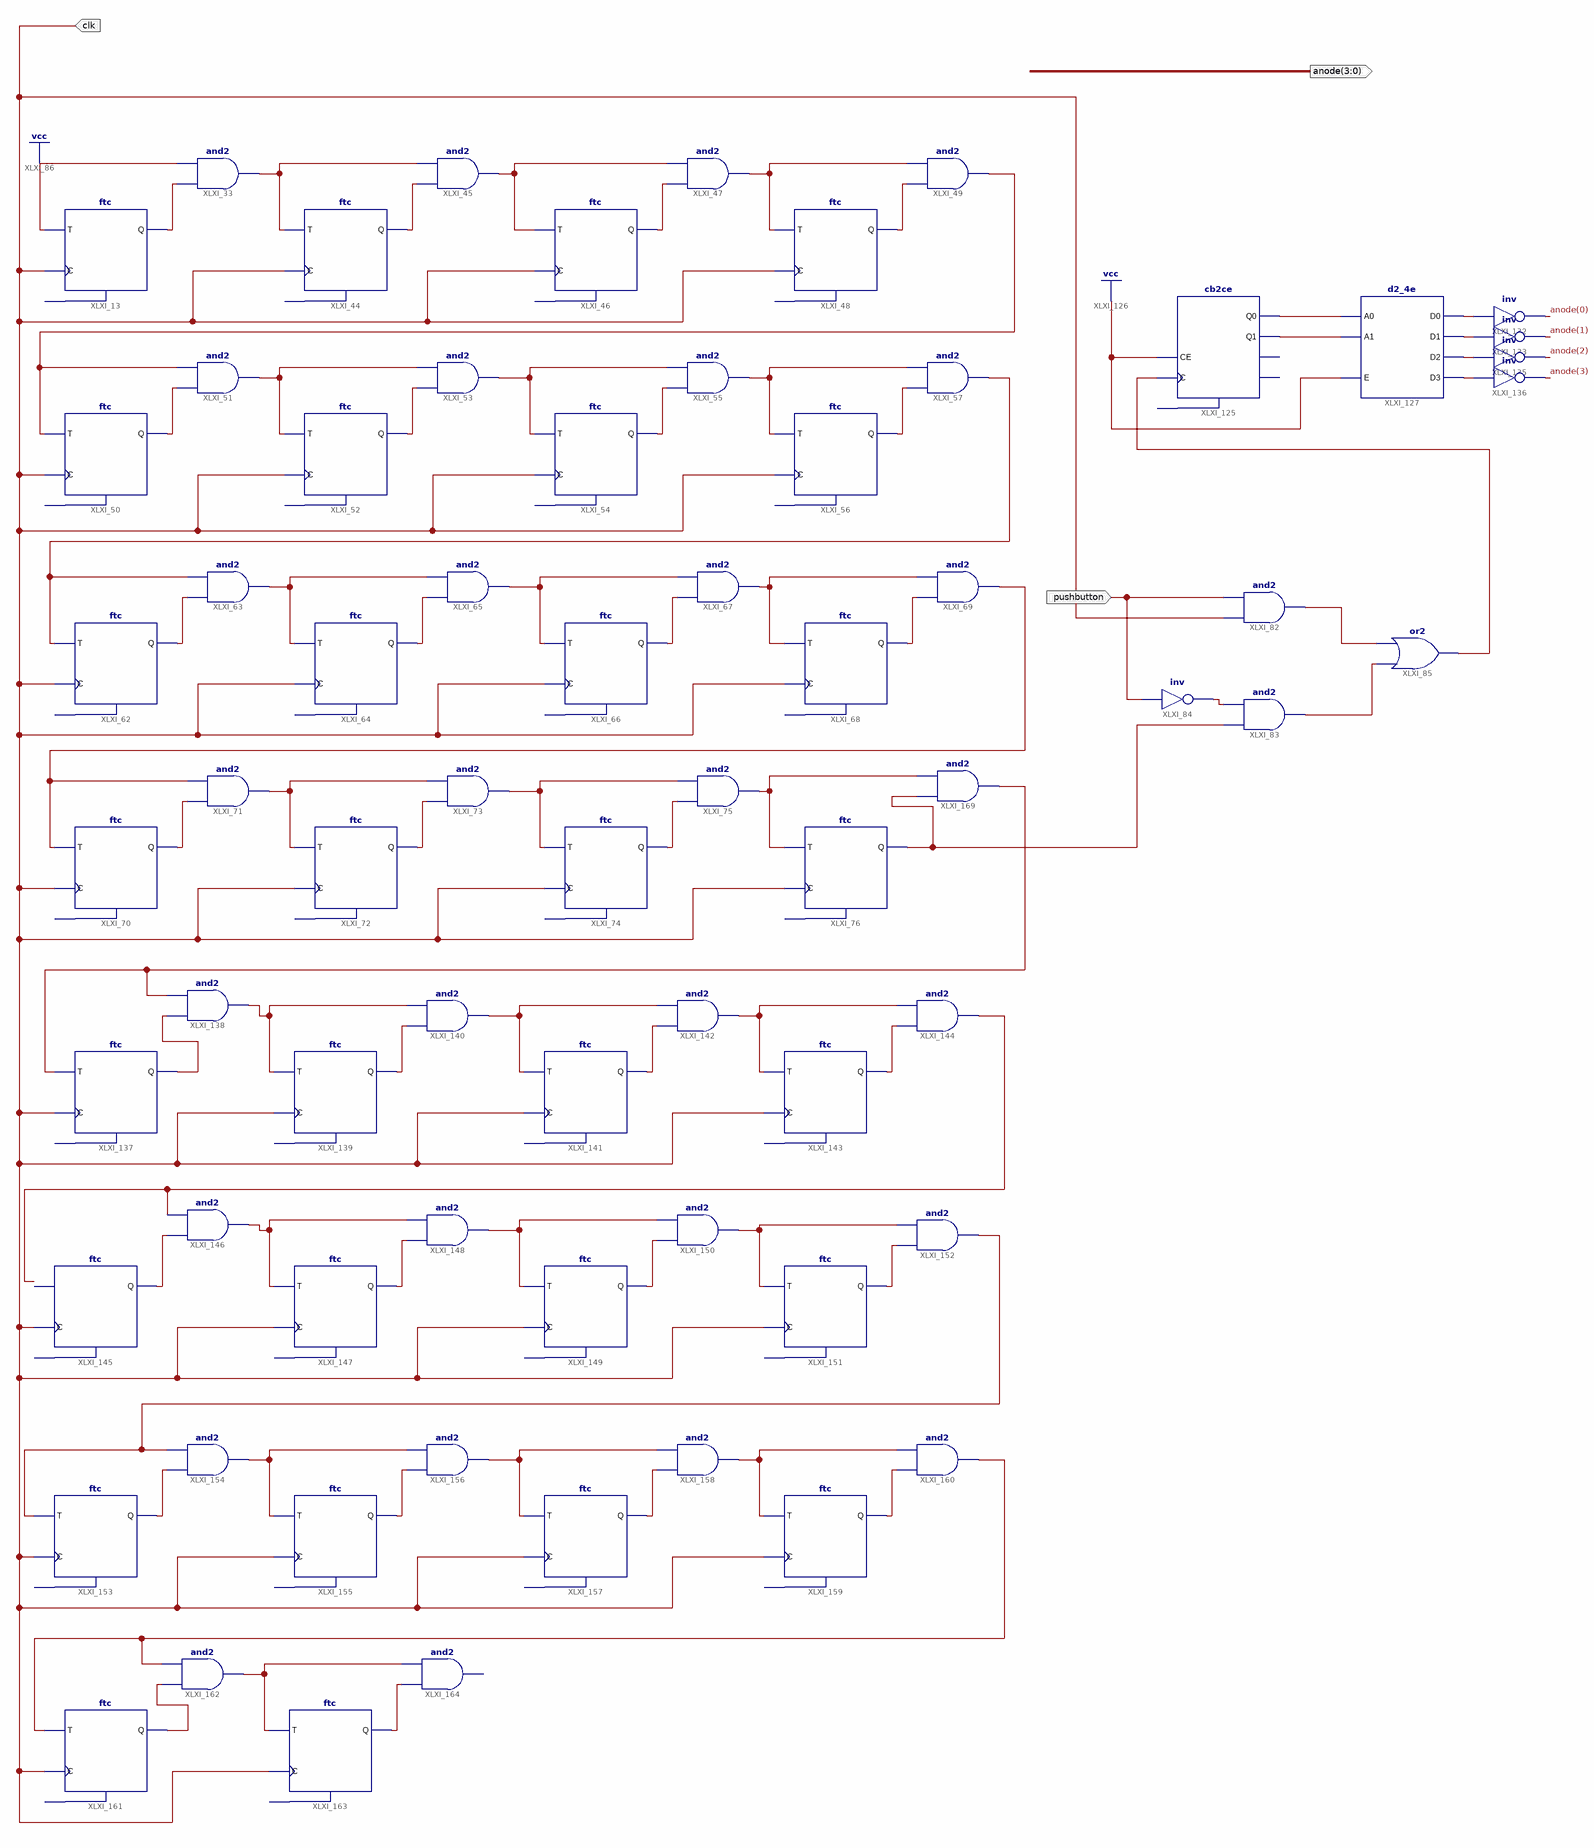
[diagram p0: schematic sheet 1]
// Xilinx ISE schematic Clocking.sch (artix7) as structural Verilog: 70 symbols, 3 ports
module Clocking (
  input  pushbutton,
  input  clk,
  output [3:0] anode
);

  wire XLXN_26, XLXN_47, XLXN_49, XLXN_52, XLXN_53, XLXN_55, XLXN_56, XLXN_58, XLXN_59, XLXN_61, XLXN_62,
       XLXN_64, XLXN_65, XLXN_67, XLXN_74, XLXN_76, XLXN_77, XLXN_79, XLXN_80, XLXN_82, XLXN_85, XLXN_86,
       XLXN_88, XLXN_89, XLXN_91, XLXN_92, XLXN_94, XLXN_114, XLXN_117, XLXN_118, XLXN_157, XLXN_160,
       XLXN_161, XLXN_172, XLXN_179, XLXN_180, XLXN_181, XLXN_182, XLXN_184, XLXN_186, XLXN_188, XLXN_190,
       XLXN_192, XLXN_194, XLXN_196, XLXN_198, XLXN_200, XLXN_202, XLXN_204, XLXN_206, XLXN_208, XLXN_210,
       XLXN_212, XLXN_214, XLXN_216, XLXN_218, XLXN_220, XLXN_222, XLXN_224, XLXN_226, XLXN_228, XLXN_230,
       XLXN_261, XLXN_269, XLXN_272, XLXN_274, XLXN_276, XLXN_285, XLXN_287;

  ftc XLXI_13 (.C(clk), .T(1'b1), .Q(XLXN_26));  // open: CLR
  and XLXI_33 (XLXN_47, XLXN_26, 1'b1);
  ftc XLXI_44 (.C(clk), .T(XLXN_47), .Q(XLXN_49));  // open: CLR
  and XLXI_45 (XLXN_172, XLXN_49, XLXN_47);
  ftc XLXI_46 (.C(clk), .T(XLXN_172), .Q(XLXN_52));  // open: CLR
  and XLXI_47 (XLXN_53, XLXN_52, XLXN_172);
  ftc XLXI_48 (.C(clk), .T(XLXN_53), .Q(XLXN_55));  // open: CLR
  and XLXI_49 (XLXN_56, XLXN_55, XLXN_53);
  ftc XLXI_50 (.C(clk), .T(XLXN_56), .Q(XLXN_58));  // open: CLR
  and XLXI_51 (XLXN_59, XLXN_58, XLXN_56);
  ftc XLXI_52 (.C(clk), .T(XLXN_59), .Q(XLXN_61));  // open: CLR
  and XLXI_53 (XLXN_62, XLXN_61, XLXN_59);
  ftc XLXI_54 (.C(clk), .T(XLXN_62), .Q(XLXN_64));  // open: CLR
  and XLXI_55 (XLXN_65, XLXN_64, XLXN_62);
  ftc XLXI_56 (.C(clk), .T(XLXN_65), .Q(XLXN_67));  // open: CLR
  and XLXI_57 (XLXN_74, XLXN_67, XLXN_65);
  ftc XLXI_62 (.C(clk), .T(XLXN_74), .Q(XLXN_76));  // open: CLR
  and XLXI_63 (XLXN_77, XLXN_76, XLXN_74);
  ftc XLXI_64 (.C(clk), .T(XLXN_77), .Q(XLXN_79));  // open: CLR
  and XLXI_65 (XLXN_80, XLXN_79, XLXN_77);
  ftc XLXI_66 (.C(clk), .T(XLXN_80), .Q(XLXN_82));  // open: CLR
  and XLXI_67 (XLXN_269, XLXN_82, XLXN_80);
  ftc XLXI_68 (.C(clk), .T(XLXN_269), .Q(XLXN_85));  // open: CLR
  and XLXI_69 (XLXN_86, XLXN_85, XLXN_269);
  ftc XLXI_70 (.C(clk), .T(XLXN_86), .Q(XLXN_88));  // open: CLR
  and XLXI_71 (XLXN_89, XLXN_88, XLXN_86);
  ftc XLXI_72 (.C(clk), .T(XLXN_89), .Q(XLXN_91));  // open: CLR
  and XLXI_73 (XLXN_92, XLXN_91, XLXN_89);
  ftc XLXI_74 (.C(clk), .T(XLXN_92), .Q(XLXN_94));  // open: CLR
  and XLXI_75 (XLXN_285, XLXN_94, XLXN_92);
  ftc XLXI_76 (.C(clk), .T(XLXN_285), .Q(XLXN_287));  // open: CLR
  and XLXI_82 (XLXN_117, clk, pushbutton);
  and XLXI_83 (XLXN_118, XLXN_287, XLXN_114);
  not XLXI_84 (XLXN_114, pushbutton);
  or XLXI_85 (XLXN_157, XLXN_118, XLXN_117);
  cb2ce XLXI_125 (.C(XLXN_157), .CE(1'b1), .Q0(XLXN_160), .Q1(XLXN_161));  // open: CLR, CEO, TC
  d2_4e XLXI_127 (.A0(XLXN_160), .A1(XLXN_161), .E(1'b1), .D0(XLXN_179), .D1(XLXN_180), .D2(XLXN_181), .D3(XLXN_182));
  not XLXI_132 (anode[0], XLXN_179);
  not XLXI_133 (anode[1], XLXN_180);
  not XLXI_135 (anode[2], XLXN_181);
  not XLXI_136 (anode[3], XLXN_182);
  ftc XLXI_137 (.C(clk), .T(XLXN_272), .Q(XLXN_184));  // open: CLR
  and XLXI_138 (XLXN_186, XLXN_184, XLXN_272);
  ftc XLXI_139 (.C(clk), .T(XLXN_186), .Q(XLXN_188));  // open: CLR
  and XLXI_140 (XLXN_190, XLXN_188, XLXN_186);
  ftc XLXI_141 (.C(clk), .T(XLXN_190), .Q(XLXN_192));  // open: CLR
  and XLXI_142 (XLXN_194, XLXN_192, XLXN_190);
  ftc XLXI_143 (.C(clk), .T(XLXN_194), .Q(XLXN_196));  // open: CLR
  and XLXI_144 (XLXN_276, XLXN_196, XLXN_194);
  ftc XLXI_145 (.C(clk), .Q(XLXN_198));  // open: CLR, T
  and XLXI_146 (XLXN_200, XLXN_198, XLXN_276);
  ftc XLXI_147 (.C(clk), .T(XLXN_200), .Q(XLXN_202));  // open: CLR
  and XLXI_148 (XLXN_204, XLXN_202, XLXN_200);
  ftc XLXI_149 (.C(clk), .T(XLXN_204), .Q(XLXN_206));  // open: CLR
  and XLXI_150 (XLXN_208, XLXN_206, XLXN_204);
  ftc XLXI_151 (.C(clk), .T(XLXN_208), .Q(XLXN_210));  // open: CLR
  and XLXI_152 (XLXN_274, XLXN_210, XLXN_208);
  ftc XLXI_153 (.C(clk), .T(XLXN_274), .Q(XLXN_212));  // open: CLR
  and XLXI_154 (XLXN_214, XLXN_212, XLXN_274);
  ftc XLXI_155 (.C(clk), .T(XLXN_214), .Q(XLXN_216));  // open: CLR
  and XLXI_156 (XLXN_218, XLXN_216, XLXN_214);
  ftc XLXI_157 (.C(clk), .T(XLXN_218), .Q(XLXN_220));  // open: CLR
  and XLXI_158 (XLXN_222, XLXN_220, XLXN_218);
  ftc XLXI_159 (.C(clk), .T(XLXN_222), .Q(XLXN_224));  // open: CLR
  and XLXI_160 (XLXN_261, XLXN_224, XLXN_222);
  ftc XLXI_161 (.C(clk), .T(XLXN_261), .Q(XLXN_226));  // open: CLR
  and XLXI_162 (XLXN_228, XLXN_226, XLXN_261);
  ftc XLXI_163 (.C(clk), .T(XLXN_228), .Q(XLXN_230));  // open: CLR
  // and2 XLXI_164 has open pins: I0=XLXN_230, I1=XLXN_228, O=open
  and XLXI_169 (XLXN_272, XLXN_287, XLXN_285);
endmodule
